# EasyEDA schematic 4.30.json
TITLE: Sheet_1; REV: 1.0; Date: 2020-11-18; Sheet: 1/1; Drawn By: Gökbey Keskin; Company: Your Company
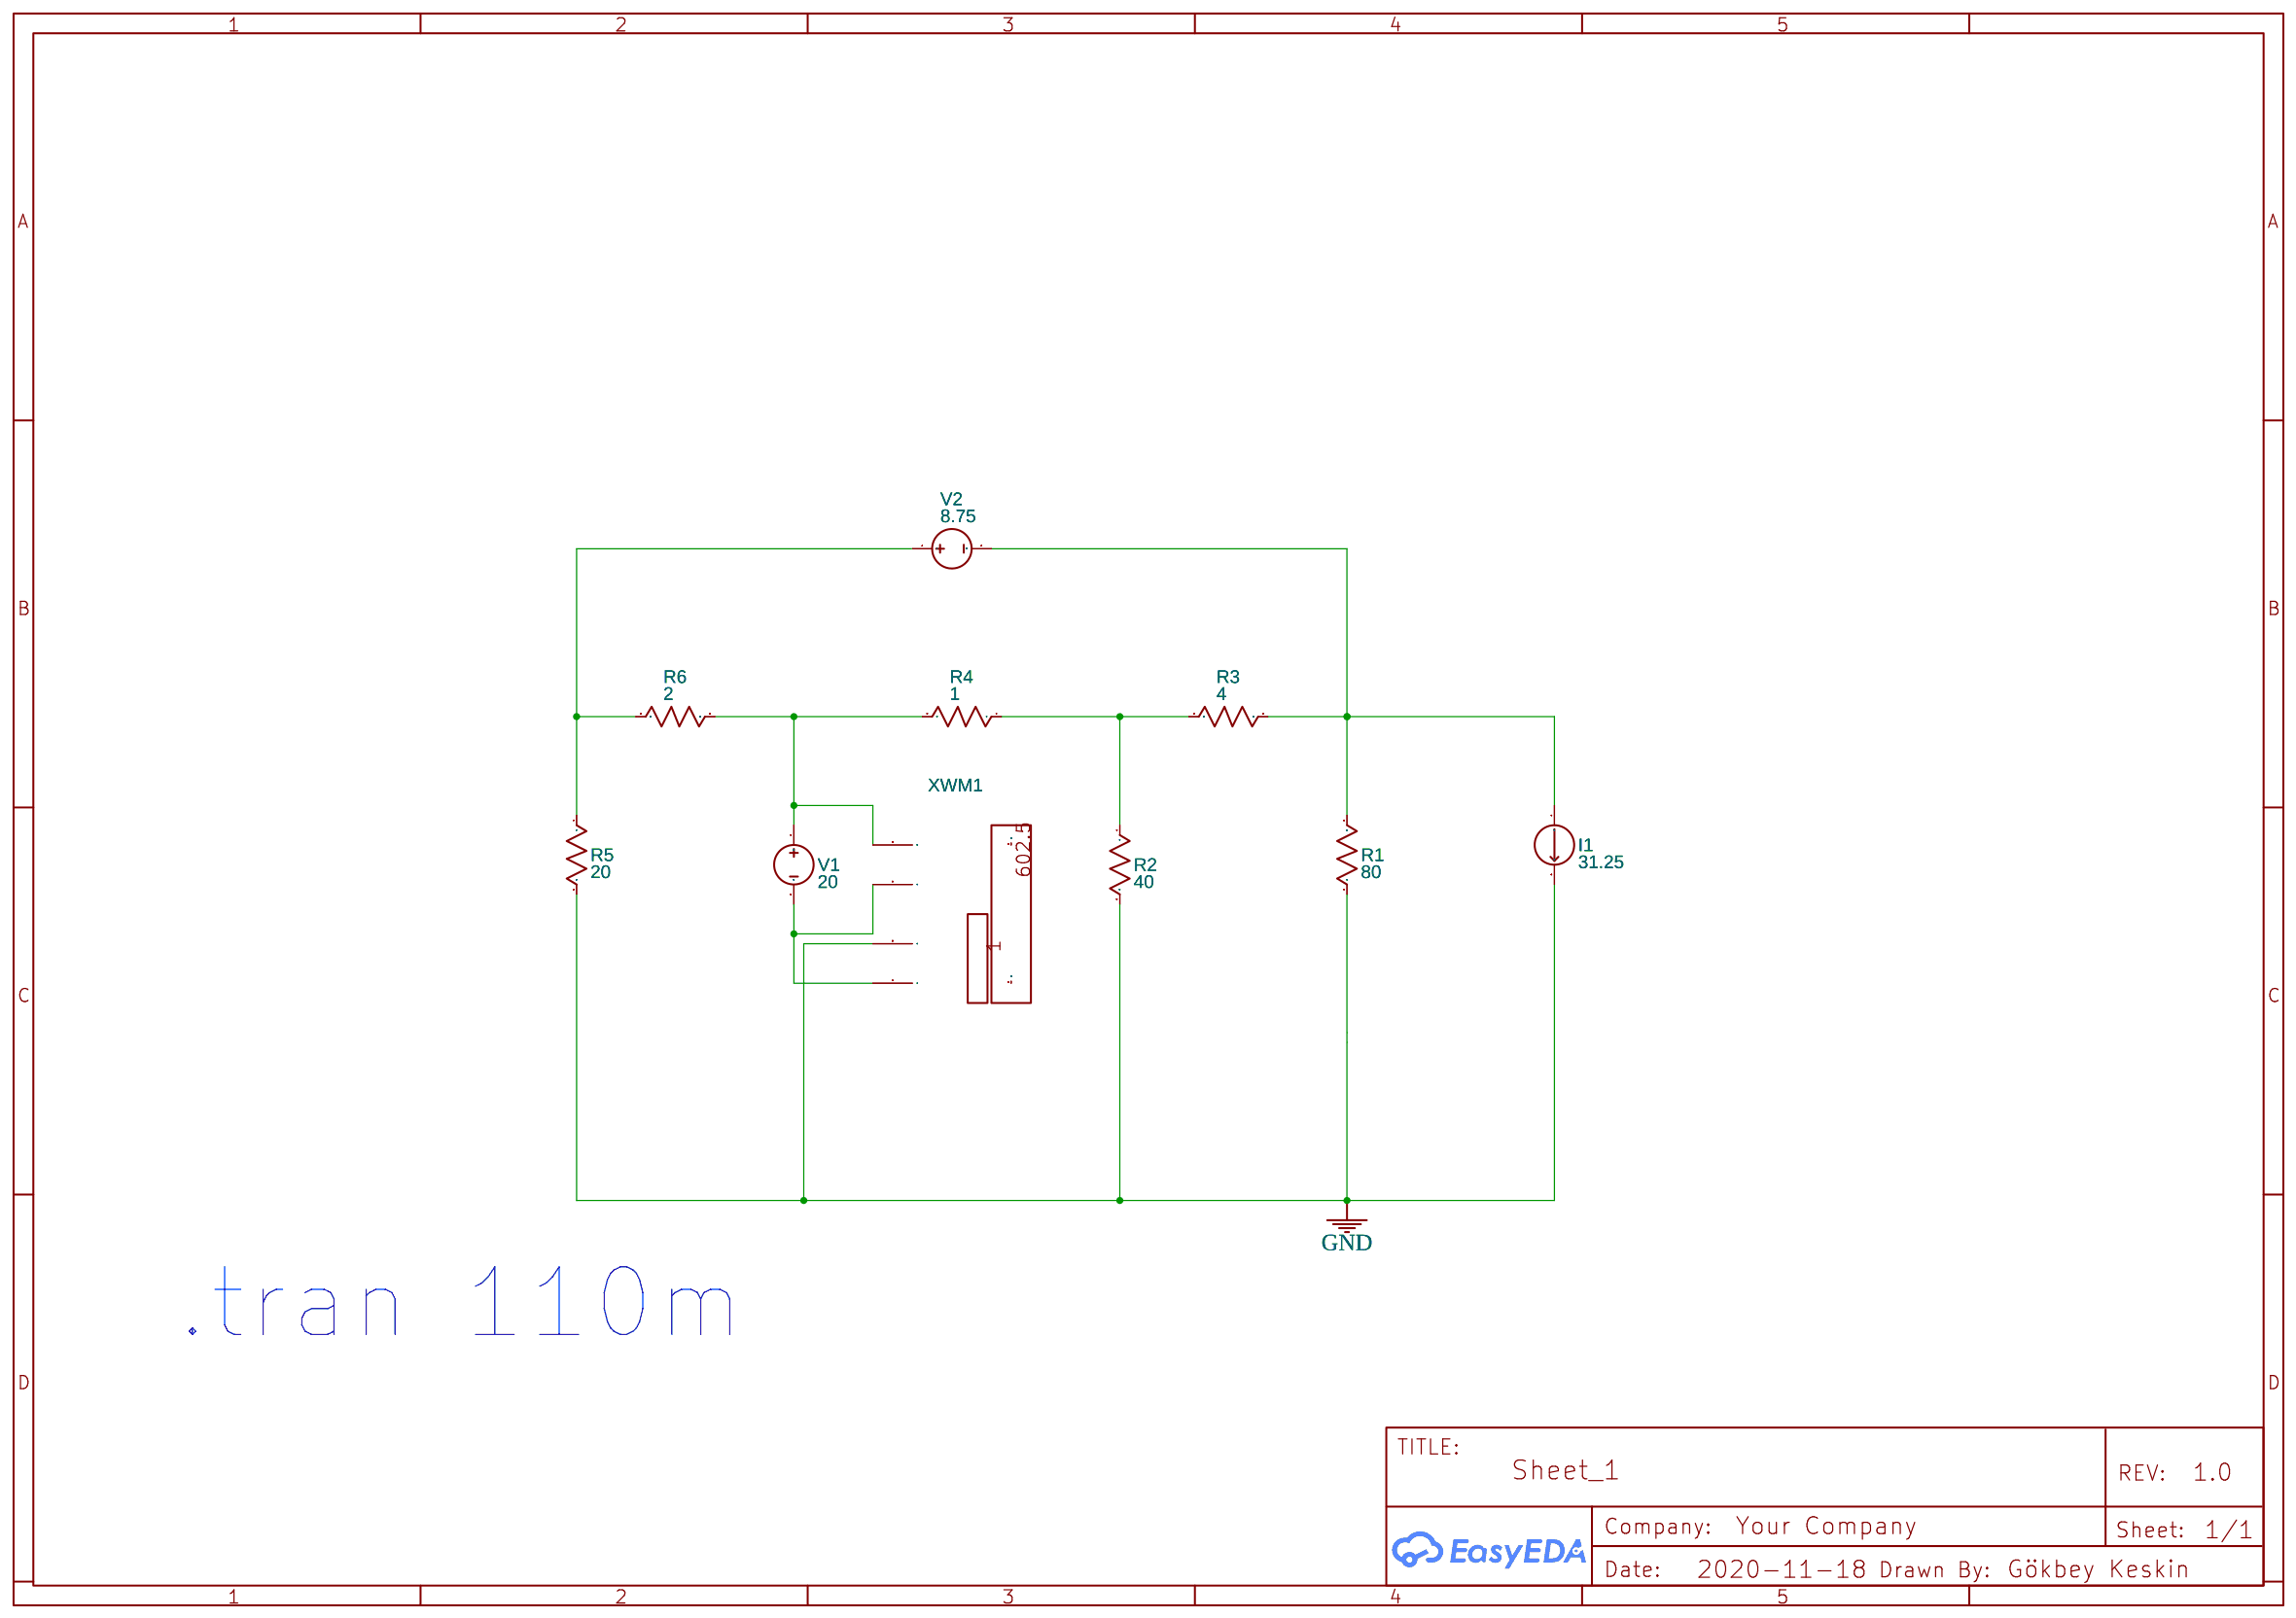
[diagram p0: schematic sheet]

## Parts
I1  31.25  [2P-5.08]
R1  80  [AXIAL-0.3]
R2  40  [AXIAL-0.3]
R3  4  [AXIAL-0.3]
R4  1  [AXIAL-0.3]
R5  20  [AXIAL-0.3]
R6  2  [AXIAL-0.3]
V1  20  [HDR1X2]
V2  8.75  [HDR1X2]
XWM1  Wattmeter

## Library data of the parts
I1 = IDC: Contributor: EasyEDA; sim: true
R1-R6 = Resistor_US: Resistance: 1k; Contributor: EasyEDA; Supplier: YUJING
V1 V2 = VDC: Contributor: EasyEDA; sim: true
XWM1 = WATTMETER: Contributor: EasyEDA; NameDisplay: 0; sim: true

## Nets
GND: I1.2 R1.1 R2.2 R5.2 XWM1.3(I+)
Net-(I1-1): I1.1 R1.2 R3.1 V2.2
Net-(R2-1): R2.1 R3.2 R4.1
Net-(R4-2): R4.2 R6.2 V1.1 XWM1.1(V+)
Net-(R5-1): R5.1 R6.1 V2.1
Net-(V1-2): V1.2 XWM1.2(V-) XWM1.4(I-)

Not connected (* = marked no-connect by the designer): XWM1 P PF

## Notes on the sheet
- .tran 110m
